# EAGLE schematic macromouse (EAGLE 7.7.0)
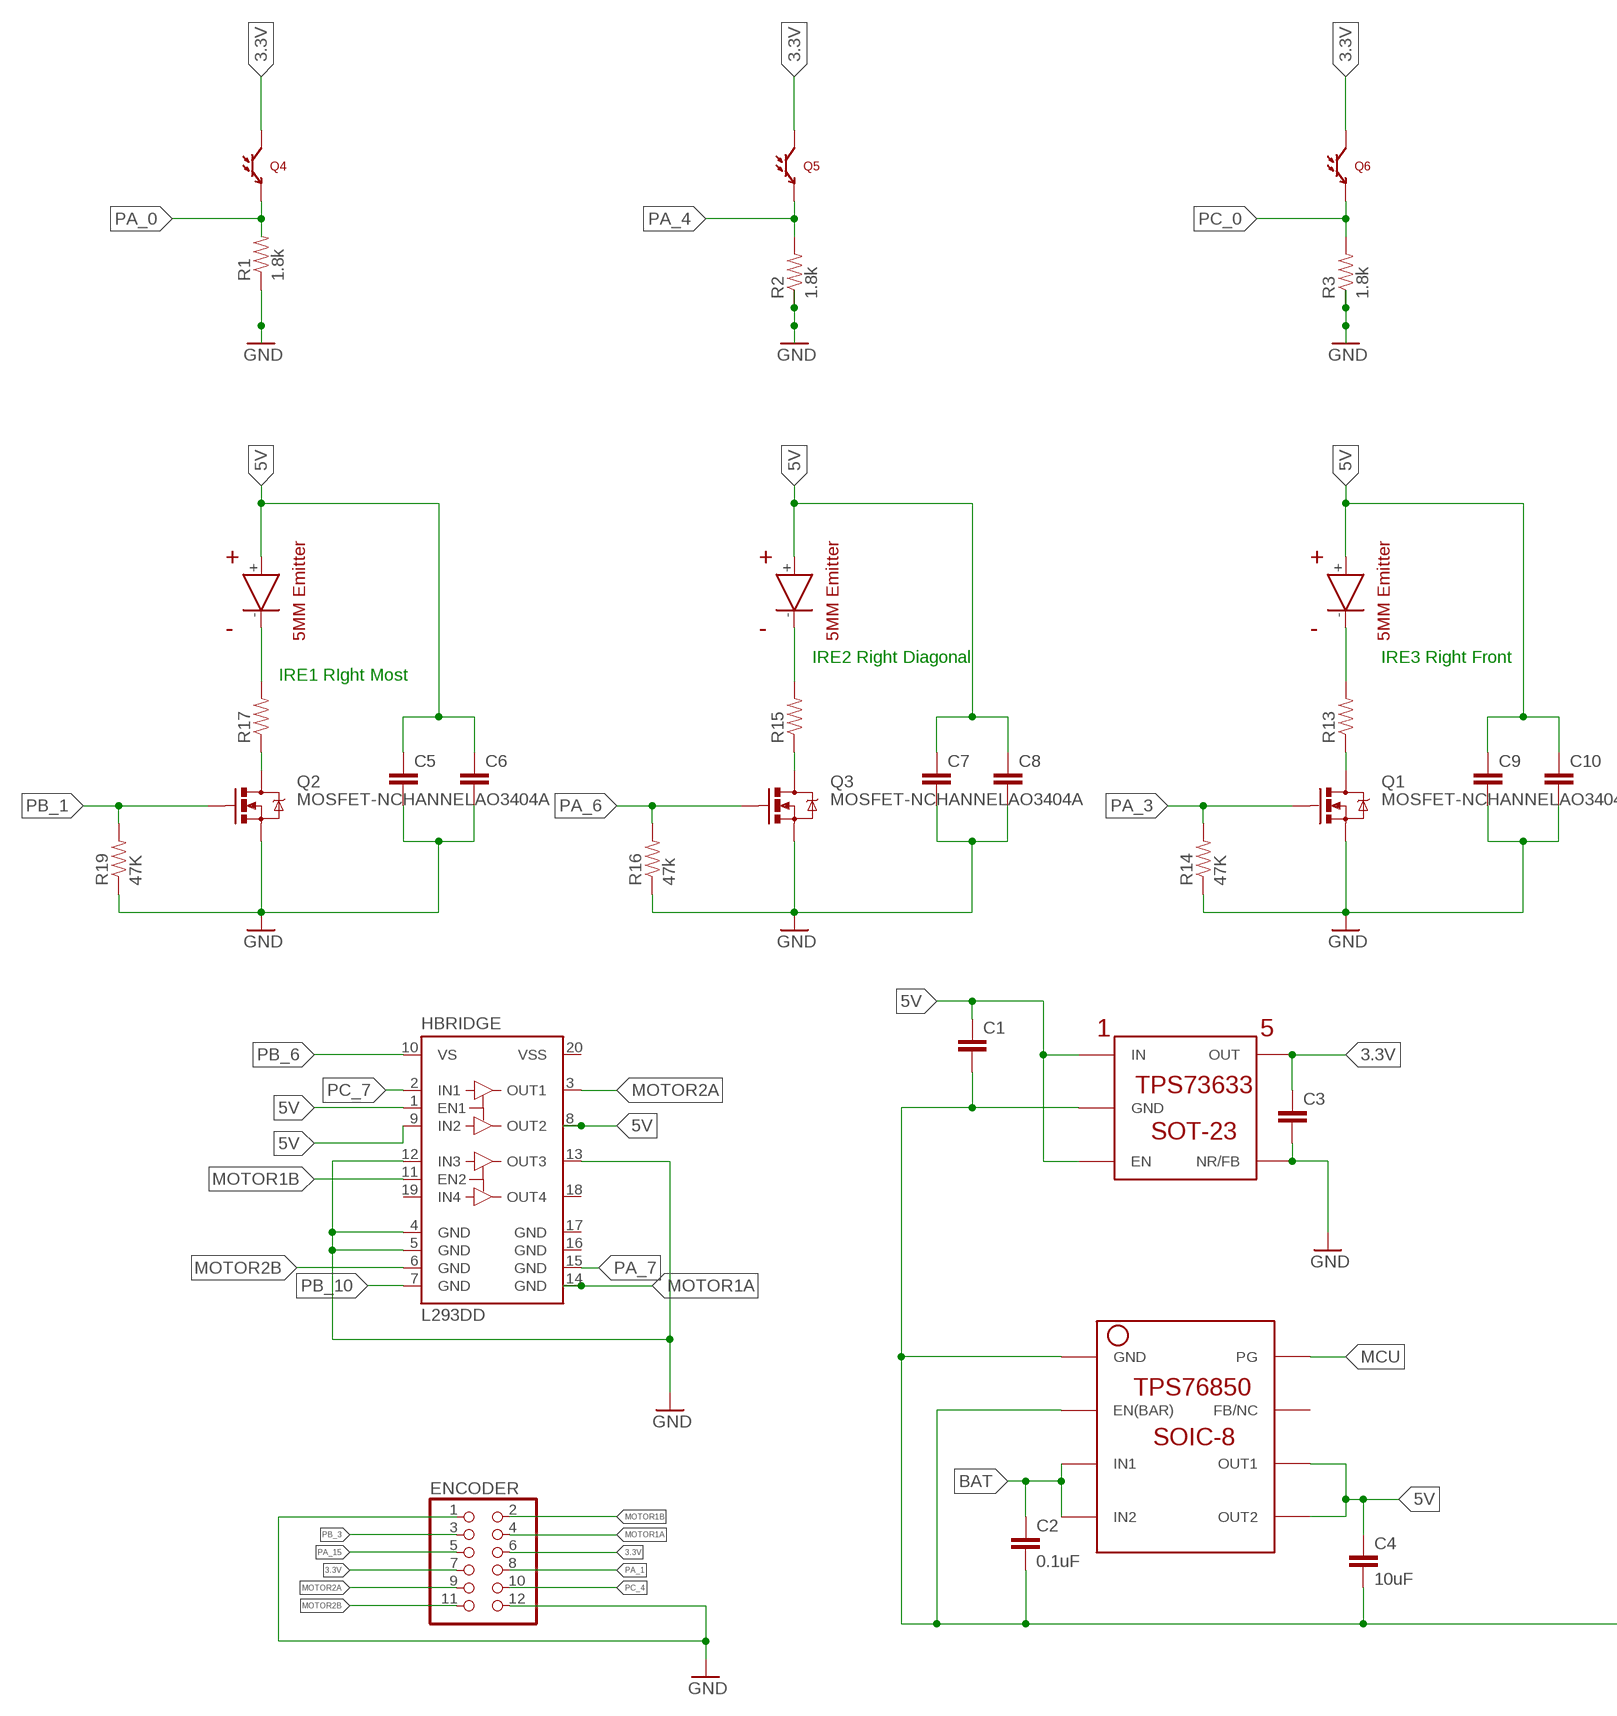
[diagram p0: schematic, sheet 1, part 1 of 2]
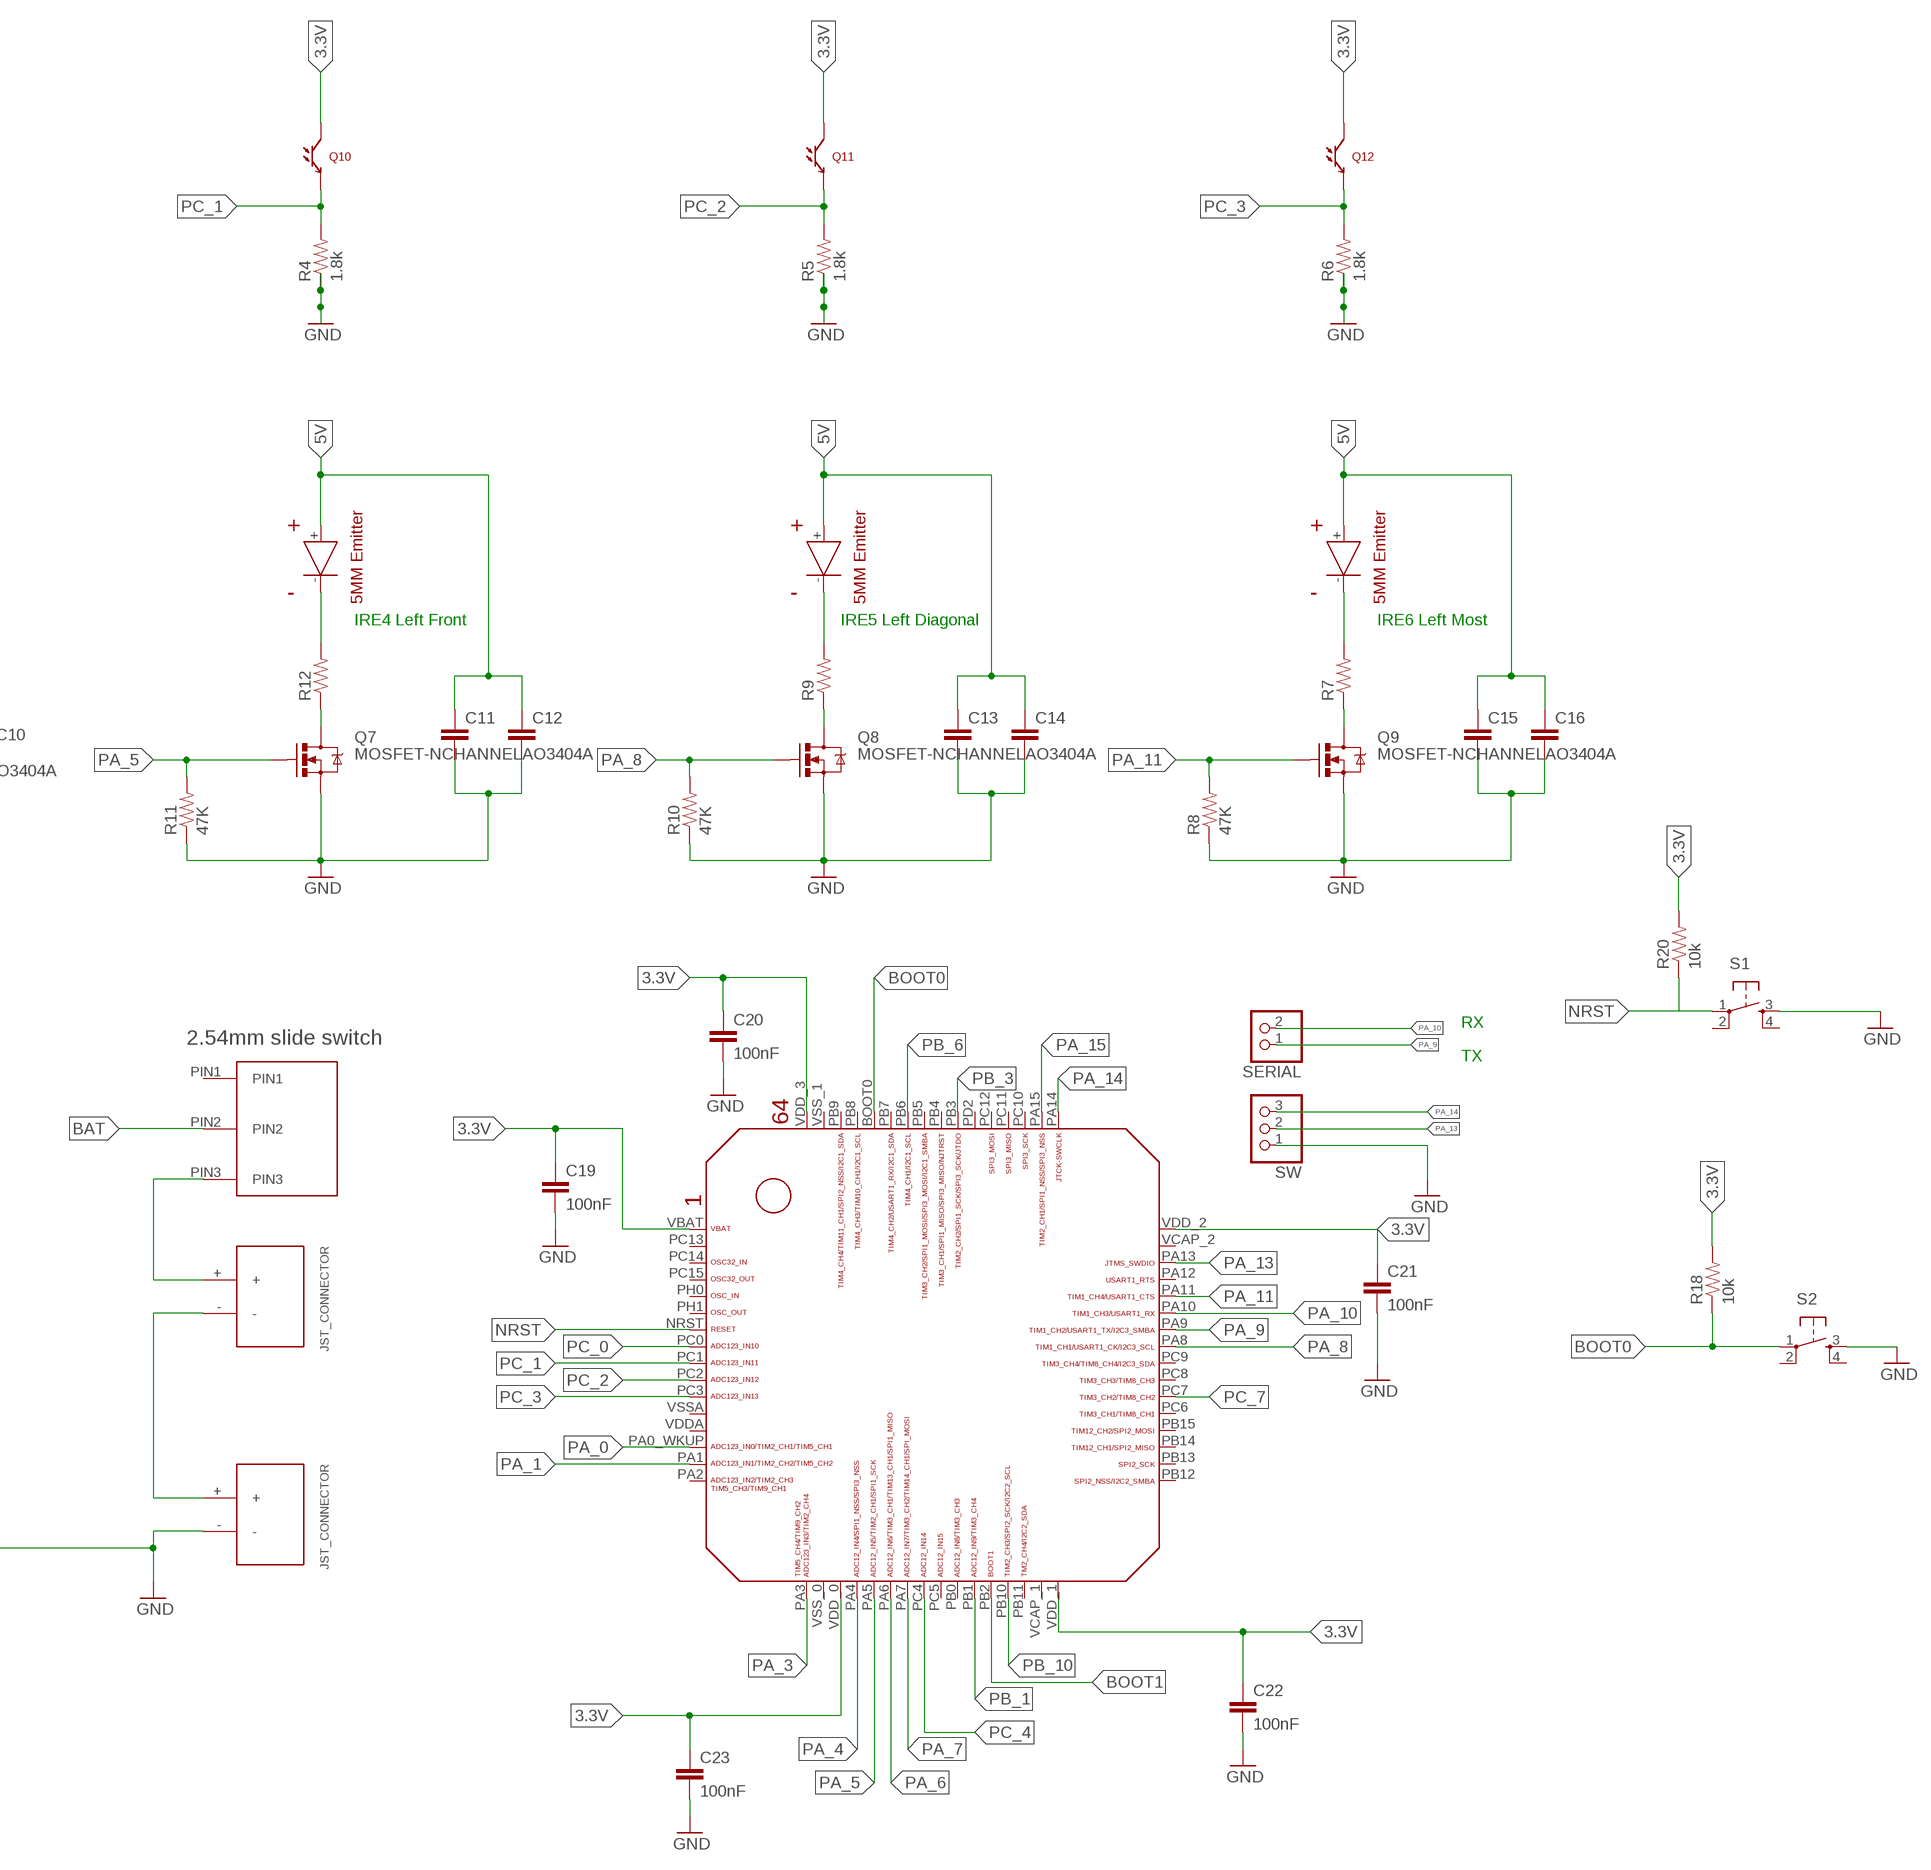
[diagram p1: schematic, sheet 1, part 2 of 2]

## Parts
C1  CAP0603-CAP  [0603-CAP]
C2  0.1uF  CAP0603-CAP  [0603-CAP]
C3  CAP0603-CAP  [0603-CAP]
C4  10uF  CAP0603-CAP  [0603-CAP]
C5  CAP0603-CAP  [0603-CAP]
C6  CAP0603-CAP  [0603-CAP]
C7  CAP0603-CAP  [0603-CAP]
C8  CAP0603-CAP  [0603-CAP]
C9  CAP0603-CAP  [0603-CAP]
C10  CAP0603-CAP  [0603-CAP]
C11  CAP0603-CAP  [0603-CAP]
C12  CAP0603-CAP  [0603-CAP]
C13  CAP0603-CAP  [0603-CAP]
C14  CAP0603-CAP  [0603-CAP]
C15  CAP0603-CAP  [0603-CAP]
C16  CAP0603-CAP  [0603-CAP]
C19  100nF  CAP0603-CAP  [0603-CAP]
C20  100nF  CAP0603-CAP  [0603-CAP]
C21  100nF  CAP0603-CAP  [0603-CAP]
C22  100nF  CAP0603-CAP  [0603-CAP]
C23  100nF  CAP0603-CAP  [0603-CAP]
ENCODER  PINHD-2X6  [2X06]
HBRIDGE  L293DD  [SO20]
IRE1  EMITTER  [EMITTER]
IRE2  EMITTER  [EMITTER]
IRE3  EMITTER  [EMITTER]
IRE4  EMITTER  [EMITTER]
IRE5  EMITTER  [EMITTER]
IRE6  EMITTER  [EMITTER]
Q1  MOSFET-NCHANNELAO3404A  [SOT23-3]
Q2  MOSFET-NCHANNELAO3404A  [SOT23-3]
Q3  MOSFET-NCHANNELAO3404A  [SOT23-3]
Q4  LTR-301  [LTR-301]
Q5  LTR-301  [LTR-301]
Q6  LTR-301  [LTR-301]
Q7  MOSFET-NCHANNELAO3404A  [SOT23-3]
Q8  MOSFET-NCHANNELAO3404A  [SOT23-3]
Q9  MOSFET-NCHANNELAO3404A  [SOT23-3]
Q10  LTR-301  [LTR-301]
Q11  LTR-301  [LTR-301]
Q12  LTR-301  [LTR-301]
R1  1.8k  RESISTOR0603-RES  [0603-RES]
R2  1.8k  RESISTOR0603-RES  [0603-RES]
R3  1.8k  RESISTOR0603-RES  [0603-RES]
R4  1.8k  RESISTOR0603-RES  [0603-RES]
R5  1.8k  RESISTOR0603-RES  [0603-RES]
R6  1.8k  RESISTOR0603-RES  [0603-RES]
R7  RESISTOR0603-RES  [0603-RES]
R8  47K  RESISTOR0603-RES  [0603-RES]
R9  RESISTOR0603-RES  [0603-RES]
R10  47K  RESISTOR0603-RES  [0603-RES]
R11  47K  RESISTOR0603-RES  [0603-RES]
R12  RESISTOR0603-RES  [0603-RES]
R13  RESISTOR0603-RES  [0603-RES]
R14  47K  RESISTOR0603-RES  [0603-RES]
R15  RESISTOR0603-RES  [0603-RES]
R16  47k  RESISTOR0603-RES  [0603-RES]
R17  RESISTOR0603-RES  [0603-RES]
R18  10k  RESISTOR0603-RES  [0603-RES]
R19  47K  RESISTOR0603-RES  [0603-RES]
R20  10k  RESISTOR0603-RES  [0603-RES]
S1  TAC_SWITCHPTH  [TACTILE-PTH]
S2  TAC_SWITCHPTH  [TACTILE-PTH]
SERIAL  PINHD-1X2  [1X02]
SW  PINHD-1X3  [1X03]
U$1  TPS76850(SOIC-8)  [TPS76850(SOIC-8)]
U$2  JST_CONNECTOR_FEMALE  [JST_CONNECTOR_FEMALE]
U$3  JST_CONNECTOR_FEMALE  [JST_CONNECTOR_FEMALE]
U$4  TS02_SWITCH  [TS02_SWITCH]
U$5  TPS73633(SOT-23)  [TPS73633(SOT-23)]
U$9  STM32F405/415_LQFP64  [STM32F405/415_LQFP64]

## Nets
0.1MICROF: C1.2 C2.2 C4.2 U$1.EN(BAR) U$1.GND U$3.- U$5.GND ; supply symbol labelled GND
3.3V: C3.1 C19.1 C20.1 C21.1 C22.1 C23.1 ENCODER.6 ENCODER.7 Q4.C Q5.C Q6.C Q10.C Q11.C Q12.C R18.2 R20.2 U$5.OUT U$9.VBAT U$9.VDD_0 U$9.VDD_1 U$9.VDD_2 U$9.VDD_3
5V: C1.1 C4.1 C5.1 C6.1 C7.1 C8.1 C9.1 C10.1 C11.1 C12.1 C13.1 C14.1 C15.1 C16.1 HBRIDGE.8(OUT2) HBRIDGE.9(IN2) IRE1.+ IRE2.+ IRE3.+ IRE4.+ IRE5.+ IRE6.+ U$1.OUT1 U$1.OUT2 U$5.EN U$5.IN
BAT: C2.1 U$1.IN1 U$1.IN2 U$4.PIN2
BOOT0: R18.1 S2.1 U$9.BOOT0
BOOT1: U$9.PB2
BOOT2: R20.1
GND: C3.2 C5.2 C6.2 C7.2 C8.2 C9.2 C10.2 C11.2 C12.2 C13.2 C14.2 C15.2 C16.2 C19.2 C20.2 C21.2 C22.2 C23.2 ENCODER.1 ENCODER.12 HBRIDGE.4(GND) HBRIDGE.5(GND) HBRIDGE.12(IN3) HBRIDGE.13(OUT3) Q1.2(S) Q2.2(S) Q3.2(S) Q7.2(S) Q8.2(S) Q9.2(S) R8.1 R10.1 R11.1 R14.1 R16.1 R19.1 S1.3 S2.3 SW.1 U$5.NR/FB
MCU: U$1.PG
MOTOR1A: ENCODER.4 HBRIDGE.14(GND)
MOTOR1B: ENCODER.2 HBRIDGE.11(EN2)
MOTOR2A: ENCODER.9 HBRIDGE.3(OUT1)
MOTOR2B: ENCODER.11 HBRIDGE.6(GND)
N$1: U$2.+ U$4.PIN3
N$2: IRE1.- R17.2
N$3: U$2.- U$3.+
N$4: Q2.3(D) R17.1
N$5: R1.1 R2.1 R3.1 R4.1 R5.1 R6.1 ; supply symbol labelled GND
N$6: IRE2.- R15.2
N$7: Q3.3(D) R15.1
N$9: IRE4.- R12.2
N$10: IRE3.- R13.2
N$11: Q1.3(D) R13.1
N$12: Q7.3(D) R12.1
N$13: HBRIDGE.1(EN1)
N$14: IRE5.- R9.2
N$15: Q8.3(D) R9.1
N$16: IRE6.- R7.2
N$17: Q9.3(D) R7.1
NRST: S1.1 U$9.NRST
PA_0: Q4.E R1.2 U$9.PA0_WKUP(PA0_AKUP)
PA_1: ENCODER.8 U$9.PA1
PA_3: Q1.1(G) R14.2 U$9.PA3
PA_4: Q5.E R2.2 U$9.PA4
PA_5: Q7.1(G) R11.2 U$9.PA5
PA_6: Q3.1(G) R16.2 U$9.PA6
PA_7: HBRIDGE.15(GND) U$9.PA7
PA_8: Q8.1(G) R10.2 U$9.PA8
PA_9: SERIAL.1 U$9.PA9
PA_10: SERIAL.2 U$9.PA10
PA_11: Q9.1(G) R8.2 U$9.PA11
PA_13: SW.2 U$9.PA13
PA_14: SW.3 U$9.PA14
PA_15: ENCODER.5 U$9.PA15
PB_1: Q2.1(G) R19.2 U$9.PB1
PB_3: ENCODER.3 U$9.PB3
PB_6: HBRIDGE.10(VS) U$9.PB6
PB_10: HBRIDGE.7(GND) U$9.PB10
PC_0: Q6.E R3.2 U$9.PC0
PC_1: Q10.E R4.2 U$9.PC1
PC_2: Q11.E R5.2 U$9.PC2
PC_3: Q12.E R6.2 U$9.PC3
PC_4: ENCODER.10 U$9.PC4
PC_7: HBRIDGE.2(IN1) U$9.PC7
Unconnected: HBRIDGE.18(OUT4) HBRIDGE.19(IN4) S1.2 S1.4 S2.2 S2.4 U$1.FB/NC U$4.PIN1 U$9.PA2 U$9.PA12 U$9.PB0 U$9.PB4 U$9.PB5 U$9.PB7 U$9.PB8 U$9.PB9 U$9.PB11 U$9.PB12 U$9.PB13 U$9.PB14 U$9.PB15 U$9.PC5 U$9.PC6 U$9.PC8 U$9.PC9 U$9.PC10 U$9.PC11 U$9.PC12 U$9.PC13 U$9.PC14 U$9.PC15 U$9.PD2 U$9.PH0 U$9.PH1 U$9.VCAP_1 U$9.VCAP_2 U$9.VDDA U$9.VSS_0 U$9.VSS_1 U$9.VSSA

## Notes on the sheet
- IRE4 Left Front | IRE5 Left Diagonal | IRE6 Left Most
- IRE2 Right Diagonal | IRE3 Right Front
- IRE1 RIght Most
- RX
- TX

## Power pins joined to a net without a drawn wire
GND: HBRIDGE.16(GND) HBRIDGE.17(GND)
VSS: HBRIDGE.20(VSS)

## Library data of the parts
C1-C16 C19-C23 = SparkFun:CAP: Capacitor Standard 0603 ceramic capacitor, and 0.1" leaded capacitor.
ENCODER = pinhead:PINHD-2X6: PIN HEADER
HBRIDGE = st-microelectronics:L293DD: PUSH-PULL FOUR CHANNEL DRIVER WITH DIODES Source: http://www.st.com/stonline/books/pdf/docs/1330.pdf; OC_FARNELL: unknown
IRE1-IRE6 = sfh4550 _ teft4300:EMITTER
Q1-Q3 Q7-Q9 = SparkFun-DiscreteSemi:MOSFET-NCHANNEL: Common NMOSFET Parts MFG P/N Store ID Prod ID FDD8780 TRANS-09984 SI7820DN TRANS-11055 FDS6630A IC-08089 2N7002PW TRANS-11151 FQP30N06L COM-10213 TRANS-10060 BSS123LT1G TRANS-08345 BSS138 TRANS-00830 BS170 2N7000; PROD_ID: TRAN-12988
Q4-Q6 Q10-Q12 = SparkFun-Sensors:LTR-301: Through-hole side-receiving IR phototransistor
R1-R20 = SparkFun:RESISTOR: Resistor Basic schematic elements and footprints for 0603, 1206, and PTH resistors.
S1 S2 = SparkFun:TAC_SWITCH: Momentary Switch Button commonly used for reset or general input. Spark Fun Electronics SKU : COM-00097
SERIAL = pinhead:PINHD-1X2: PIN HEADER
SW = pinhead:PINHD-1X3: PIN HEADER
U$1 = TPS76850(SOIC-8):TPS76850(SOIC-8)
U$2 U$3 = JST_CONNECTOR_FEMALE. through hole:JST_CONNECTOR_FEMALE
U$4 = 2.54mm slide switch:TS02_SWITCH
U$5 = TPS73633(SOT-23):TPS73633(SOT-23)
U$9 = STM32F10x F4xx:STM32F405/415_LQFP64